# EAGLE design SuperCapacitor Schmatic V3 (EAGLE 9.5.2)
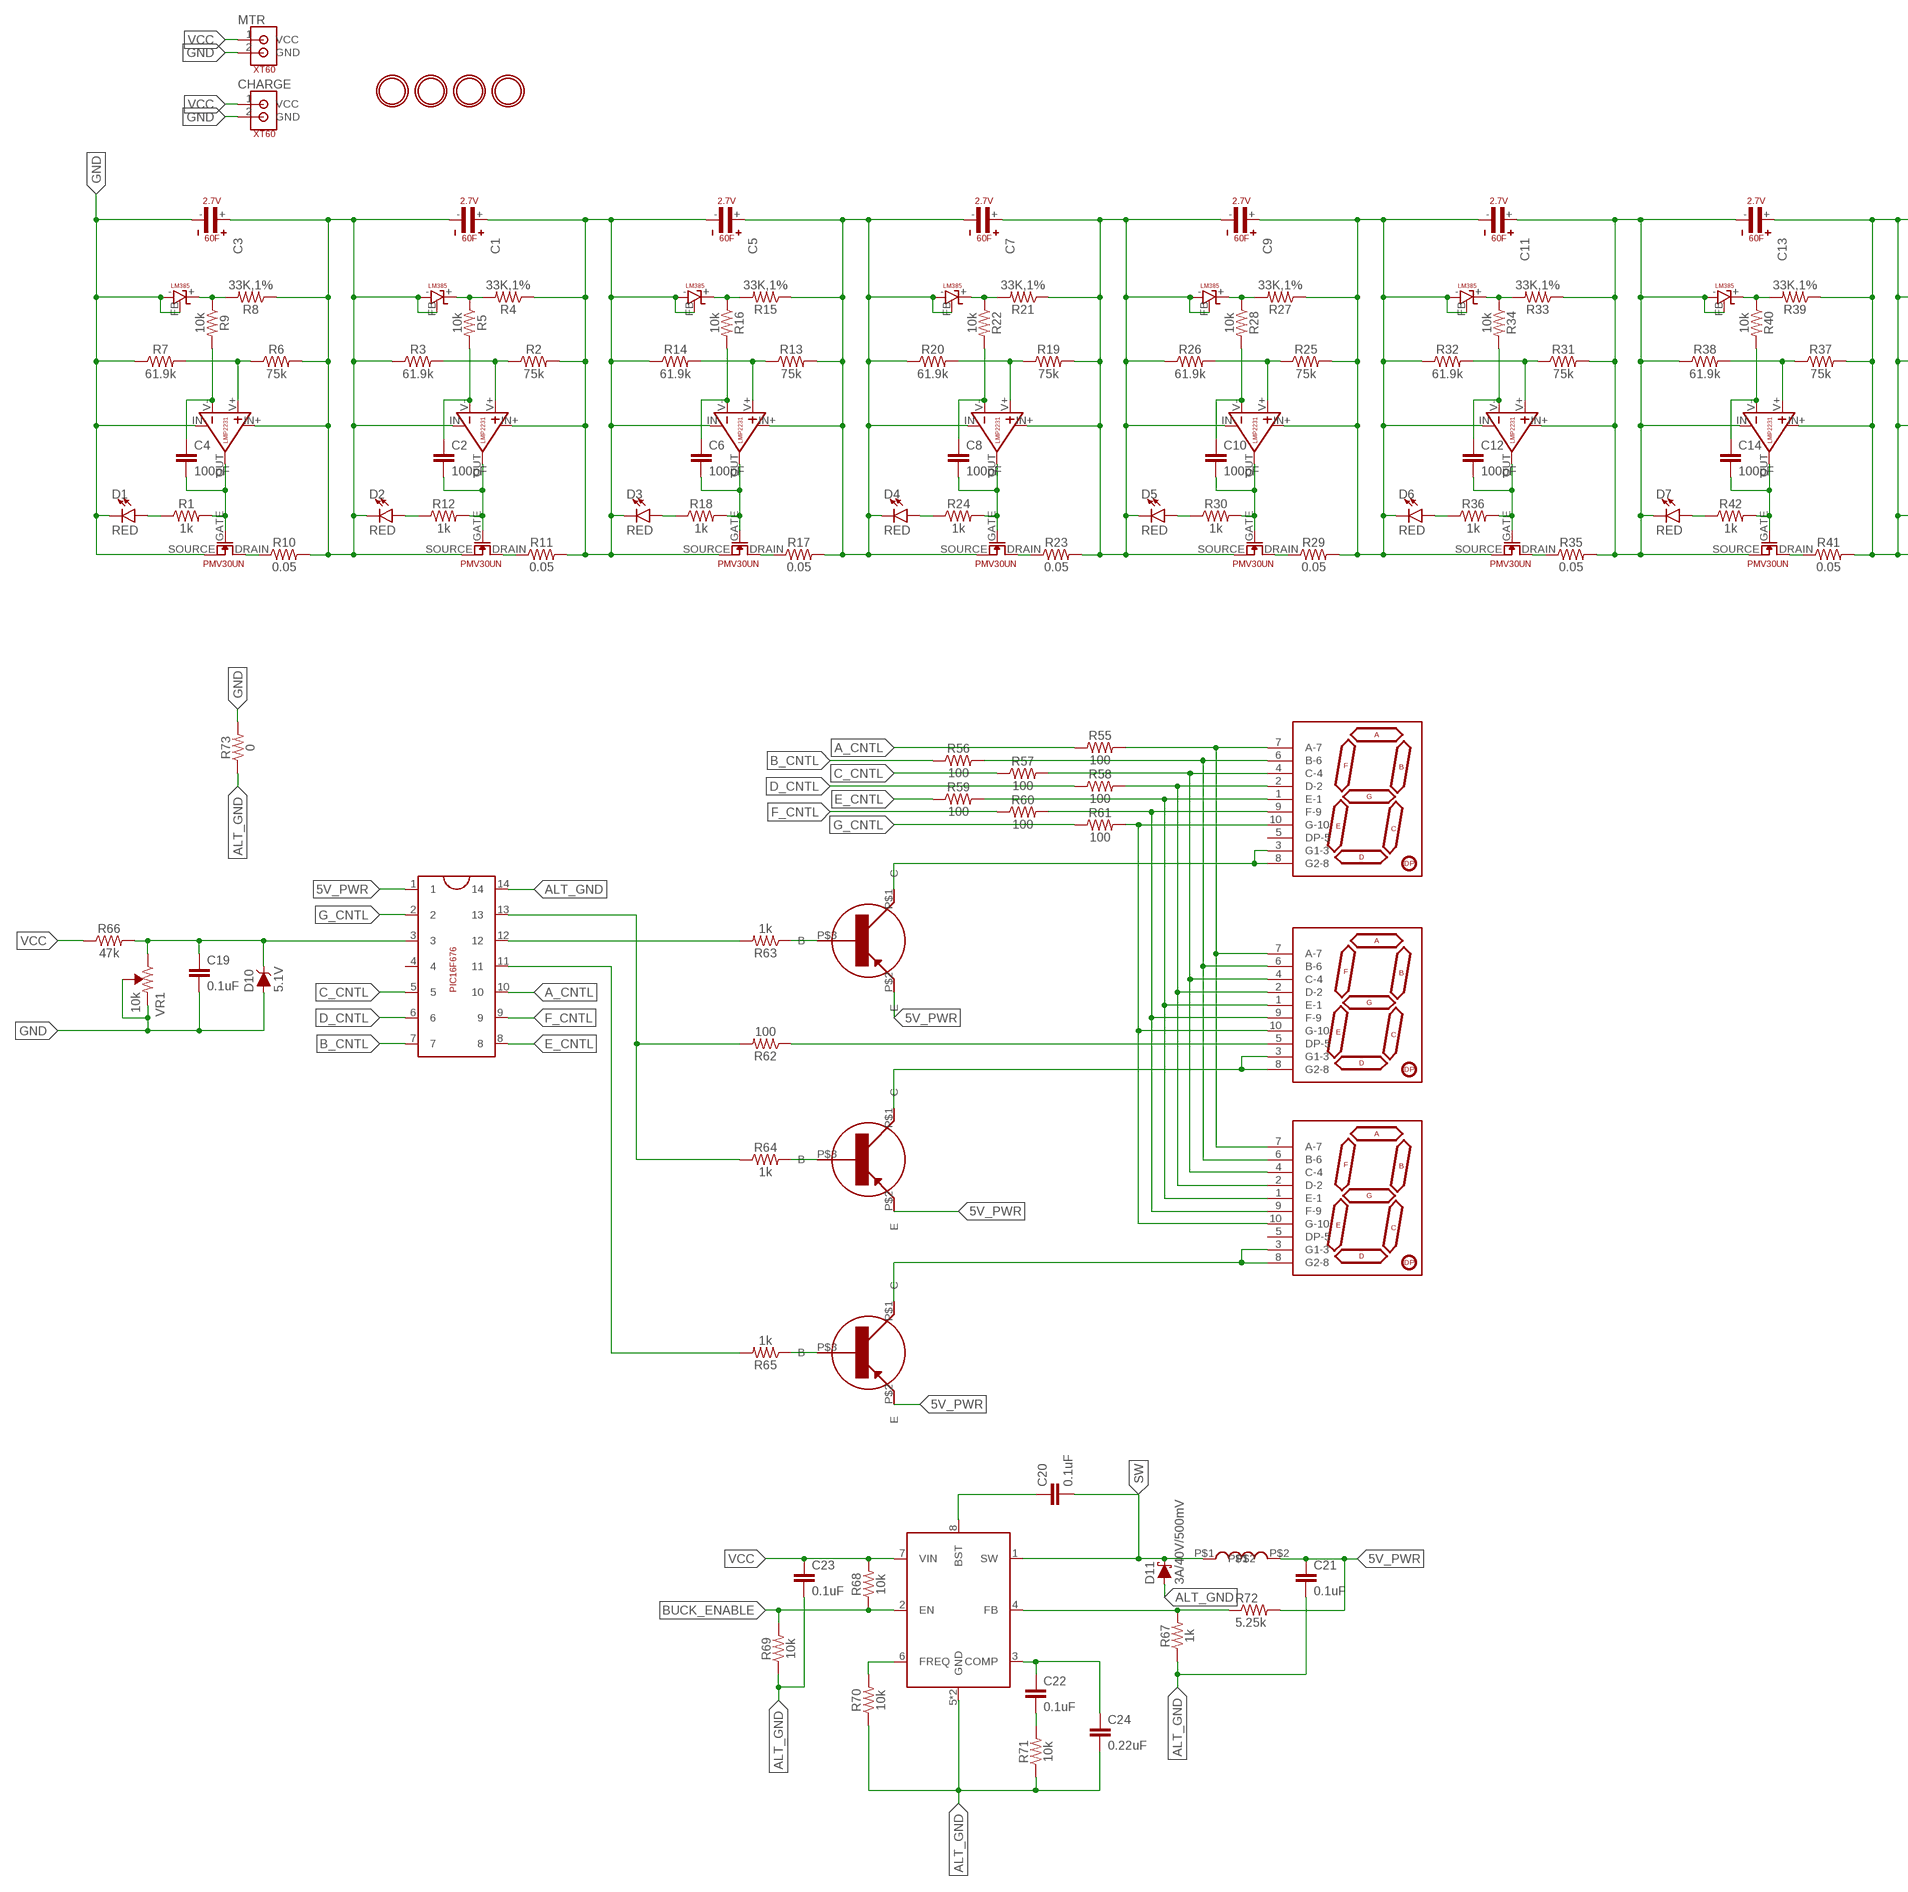
[diagram p0: schematic, sheet 1, part 1 of 2]
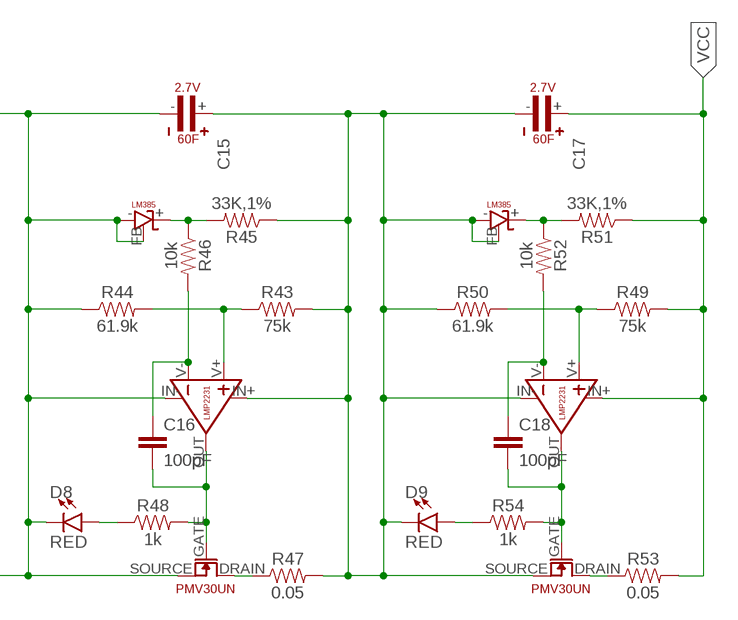
[diagram p1: schematic, sheet 1, part 2 of 2]

## Parts
3.3V_BUCK  SOIC8E  [SOIC127P600X170-9N]
C1  2.7V 60F  2.7V_60F  [2.7V_60F]
C2  100pF  100PF-0603-50V-5%  [0603]
C3  2.7V 60F  2.7V_60F  [2.7V_60F]
C4  100pF  100PF-0603-50V-5%  [0603]
C5  2.7V 60F  2.7V_60F  [2.7V_60F]
C6  100pF  100PF-0603-50V-5%  [0603]
C7  2.7V 60F  2.7V_60F  [2.7V_60F]
C8  100pF  100PF-0603-50V-5%  [0603]
C9  2.7V 60F  2.7V_60F  [2.7V_60F]
C10  100pF  100PF-0603-50V-5%  [0603]
C11  2.7V 60F  2.7V_60F  [2.7V_60F]
C12  100pF  100PF-0603-50V-5%  [0603]
C13  2.7V 60F  2.7V_60F  [2.7V_60F]
C14  100pF  100PF-0603-50V-5%  [0603]
C15  2.7V 60F  2.7V_60F  [2.7V_60F]
C16  100pF  100PF-0603-50V-5%  [0603]
C17  2.7V 60F  2.7V_60F  [2.7V_60F]
C18  100pF  100PF-0603-50V-5%  [0603]
C19  0.1uF  0.1UF-0603-25V-5%  [0603]
C20  0.1uF  0.1UF-0603-25V-(+80/-20%)  [0603]
C21  0.1uF  0.1UF-0603-25V-(+80/-20%)  [0603]
C22  0.1uF  0.1UF-0603-25V-(+80/-20%)  [0603]
C23  0.1uF  0.1UF-0603-25V-(+80/-20%)  [0603]
C24  0.22uF  0.22UF-0603-50V-(-20/+80%)  [0603]
CHARGE  XT60_CIRCLE  [XT60_CIRCLE]
D1  RED  LED-RED0603  [LED-0603]
D2  RED  LED-RED0603  [LED-0603]
D3  RED  LED-RED0603  [LED-0603]
D4  RED  LED-RED0603  [LED-0603]
D5  RED  LED-RED0603  [LED-0603]
D6  RED  LED-RED0603  [LED-0603]
D7  RED  LED-RED0603  [LED-0603]
D8  RED  LED-RED0603  [LED-0603]
D9  RED  LED-RED0603  [LED-0603]
D10  5.1V  DIODE-ZENER-MMSZ5232BS  [SOD-323]
D11  3A/40V/500mV  DIODE-SCHOTTKY-B340A  [SMA-DIODE]
MTR  XT60_CIRCLE  [XT60_CIRCLE]
R1  1k  1KOHM-0603-1/10W-1%  [0603]
R2  75k  75KOHM-0603-1/10W-1%  [0603@1]
R3  61.9k  75KOHM-0603-1/10W-1%  [0603@1]
R4  33K,1%  1MOHM-0603-1/4W-5%  [0603@1]
R5  10k  10KOHM-0603-1/10W-1%  [0603]
R6  75k  75KOHM-0603-1/10W-1%  [0603@1]
R7  61.9k  75KOHM-0603-1/10W-1%  [0603@1]
R8  33K,1%  1MOHM-0603-1/4W-5%  [0603@1]
R9  10k  10KOHM-0603-1/10W-1%  [0603]
R10  0.05  0.05OHM-2512-3W-1%  [2512]
R11  0.05  0.05OHM-2512-3W-1%  [2512]
R12  1k  1KOHM-0603-1/10W-1%  [0603]
R13  75k  75KOHM-0603-1/10W-1%  [0603@1]
R14  61.9k  75KOHM-0603-1/10W-1%  [0603@1]
R15  33K,1%  1MOHM-0603-1/4W-5%  [0603@1]
R16  10k  10KOHM-0603-1/10W-1%  [0603]
R17  0.05  0.05OHM-2512-3W-1%  [2512]
R18  1k  1KOHM-0603-1/10W-1%  [0603]
R19  75k  75KOHM-0603-1/10W-1%  [0603@1]
R20  61.9k  75KOHM-0603-1/10W-1%  [0603@1]
R21  33K,1%  1MOHM-0603-1/4W-5%  [0603@1]
R22  10k  10KOHM-0603-1/10W-1%  [0603]
R23  0.05  0.05OHM-2512-3W-1%  [2512]
R24  1k  1KOHM-0603-1/10W-1%  [0603]
R25  75k  75KOHM-0603-1/10W-1%  [0603@1]
R26  61.9k  75KOHM-0603-1/10W-1%  [0603@1]
R27  33K,1%  1MOHM-0603-1/4W-5%  [0603@1]
R28  10k  10KOHM-0603-1/10W-1%  [0603]
R29  0.05  0.05OHM-2512-3W-1%  [2512]
R30  1k  1KOHM-0603-1/10W-1%  [0603]
R31  75k  75KOHM-0603-1/10W-1%  [0603@1]
R32  61.9k  75KOHM-0603-1/10W-1%  [0603@1]
R33  33K,1%  1MOHM-0603-1/4W-5%  [0603@1]
R34  10k  10KOHM-0603-1/10W-1%  [0603]
R35  0.05  0.05OHM-2512-3W-1%  [2512]
R36  1k  1KOHM-0603-1/10W-1%  [0603]
R37  75k  75KOHM-0603-1/10W-1%  [0603@1]
R38  61.9k  75KOHM-0603-1/10W-1%  [0603@1]
R39  33K,1%  1MOHM-0603-1/4W-5%  [0603@1]
R40  10k  10KOHM-0603-1/10W-1%  [0603]
R41  0.05  0.05OHM-2512-3W-1%  [2512]
R42  1k  1KOHM-0603-1/10W-1%  [0603]
R43  75k  75KOHM-0603-1/10W-1%  [0603@1]
R44  61.9k  75KOHM-0603-1/10W-1%  [0603@1]
R45  33K,1%  1MOHM-0603-1/4W-5%  [0603@1]
R46  10k  10KOHM-0603-1/10W-1%  [0603]
R47  0.05  0.05OHM-2512-3W-1%  [2512]
R48  1k  1KOHM-0603-1/10W-1%  [0603]
R49  75k  75KOHM-0603-1/10W-1%  [0603@1]
R50  61.9k  75KOHM-0603-1/10W-1%  [0603@1]
R51  33K,1%  1MOHM-0603-1/4W-5%  [0603@1]
R52  10k  10KOHM-0603-1/10W-1%  [0603]
R53  0.05  0.05OHM-2512-3W-1%  [2512]
R54  1k  1KOHM-0603-1/10W-1%  [0603]
R55  100  100OHM-0603-1/4W-5%  [0603]
R56  100  100OHM-0603-1/4W-5%  [0603]
R57  100  100OHM-0603-1/4W-5%  [0603]
R58  100  100OHM-0603-1/4W-5%  [0603]
R59  100  100OHM-0603-1/4W-5%  [0603]
R60  100  100OHM-0603-1/4W-5%  [0603]
R61  100  100OHM-0603-1/4W-5%  [0603]
R62  100  100OHM-0603-1/4W-5%  [0603]
R63  1k  1KOHM-0603-1/10W-1%  [0603]
R64  1k  1KOHM-0603-1/10W-1%  [0603]
R65  1k  1KOHM-0603-1/10W-1%  [0603]
R66  47k  47KOHM-0603-1/10W-1%  [0603]
R67  1k  1KOHM-0603-1/10W-1%  [0603]
R68  10k  10KOHM-0603-1/10W-1%  [0603]
R69  10k  10KOHM-0603-1/10W-1%  [0603]
R70  10k  10KOHM-0603-1/10W-1%  [0603]
R71  10k  10KOHM-0603-1/10W-1%  [0603]
R72  5.25k  CRCW08050000Z0EA  [RES_0805]
R73  0  0OHM-0603-1/10W-5%  [0603]
U$1  LMP2231  [LMP2231_SOT23_5]
U$2  LM385  [LM385_SOT23]
U$3  PMV30UN_MOS  [PMV30UN_SOT23]
U$4  LMP2231  [LMP2231_SOT23_5]
U$5  LM385  [LM385_SOT23]
U$6  PMV30UN_MOS  [PMV30UN_SOT23]
U$7  LMP2231  [LMP2231_SOT23_5]
U$8  LM385  [LM385_SOT23]
U$9  PMV30UN_MOS  [PMV30UN_SOT23]
U$10  LMP2231  [LMP2231_SOT23_5]
U$11  LM385  [LM385_SOT23]
U$12  PMV30UN_MOS  [PMV30UN_SOT23]
U$13  LMP2231  [LMP2231_SOT23_5]
U$14  LM385  [LM385_SOT23]
U$15  PMV30UN_MOS  [PMV30UN_SOT23]
U$16  LMP2231  [LMP2231_SOT23_5]
U$17  LM385  [LM385_SOT23]
U$18  PMV30UN_MOS  [PMV30UN_SOT23]
U$19  LMP2231  [LMP2231_SOT23_5]
U$20  LM385  [LM385_SOT23]
U$21  PMV30UN_MOS  [PMV30UN_SOT23]
U$22  LMP2231  [LMP2231_SOT23_5]
U$23  LM385  [LM385_SOT23]
U$24  PMV30UN_MOS  [PMV30UN_SOT23]
U$25  LMP2231  [LMP2231_SOT23_5]
U$26  LM385  [LM385_SOT23]
U$27  PMV30UN_MOS  [PMV30UN_SOT23]
U$30  M5  [M5]
U$31  M5  [M5]
U$32  M5  [M5]
U$33  M5  [M5]
U$35  DSM7T  [7-SEGMENT_SMD]
U$36  DSM7T  [7-SEGMENT_SMD]
U$37  DSM7T  [7-SEGMENT_SMD]
U$38  PIC16F676  [PIC16F676]
U$39  4.7UH_INDUCTOR  [4.7UH_INDUCTOR]
U$40  SOT_223  [BC856BMB]
U$41  SOT_223  [BC856BMB]
U$42  SOT_223  [BC856BMB]
VR1  10k  TRIMPOT-SMD-3MM-OPEN-1/10W-25%  [TRIMPOT-SMD-TC33X]

## Nets
1 [discharge]: R17.P$1 U$9.DRAIN
5V_PWR: C21.1 R72.2 U$38.1 U$39.P$2 U$40.P$2(E) U$41.P$2(E) U$42.P$2(E)
A_CNTL: R55.1 U$38.10
ALT_GND [discharge]: 3.3V_BUCK.5(GND) 3.3V_BUCK.9(GND) C21.2 C23.2 C24.2 D11.A R67.1 R69.1 R70.1 R71.1 R73.1 U$38.14
B_CNTL: R56.1 U$38.7
BUCK_ENABLE: 3.3V_BUCK.2(EN) R68.1 R69.2
C_CNTL: R57.1 U$38.5
D_CNTL: R58.1 U$38.6
E_CNTL: R59.1 U$38.8
F_CNTL: R60.1 U$38.9
G_CNTL: R61.1 U$38.2
GND [discharge]: C3.- C19.2 CHARGE.2(GND) D1.C D10.A MTR.2(GND) R7.1 R73.2 U$4.IN- U$5.- U$5.FB U$6.SOURCE VR1.2(WIPER) VR1.3(CCW)
N$1: D1.A R1.1
N$2: U$37.3(G1-3) U$37.8(G2-8) U$41.P$1(C)
N$3: C2.2 R12.2 U$1.OUT U$3.GATE
N$4 [discharge]: C1.- C3.+ D2.C R3.1 R6.2 R8.1 R10.P$2 U$1.IN- U$2.- U$2.FB U$3.SOURCE U$4.IN+
N$5: R2.1 R3.2 U$1.V+
N$6: C2.1 R5.2 U$1.V-
N$7: R4.2 R5.1 U$2.+
N$8: U$36.3(G1-3) U$36.8(G2-8) U$42.P$1(C)
N$9: C4.2 R1.2 U$4.OUT U$6.GATE
N$10: R63.1 U$40.P$3(B)
N$11: R6.1 R7.2 U$4.V+
N$12: C4.1 R9.2 U$4.V-
N$13: R8.2 R9.1 U$5.+
N$14 [discharge]: R10.P$1 U$6.DRAIN
N$15 [discharge]: R11.P$1 U$3.DRAIN
N$16: D2.A R12.1
N$17: R64.2 U$41.P$3(B)
N$18: C6.2 R18.2 U$7.OUT U$9.GATE
N$19 [discharge]: C1.+ C5.- D3.C R2.2 R4.1 R11.P$2 R14.1 U$1.IN+ U$7.IN- U$8.- U$8.FB U$9.SOURCE
N$20: R13.1 R14.2 U$7.V+
N$21: C6.1 R16.2 U$7.V-
N$22: R15.2 R16.1 U$8.+
N$23: R62.1 U$37.5(DP-5)
N$24: D3.A R18.1
N$25: R62.2 R64.1 U$38.13
N$26: C8.2 R24.2 U$10.OUT U$12.GATE
N$27 [discharge]: C5.+ C7.- D4.C R13.2 R15.1 R17.P$2 R20.1 U$7.IN+ U$10.IN- U$11.- U$11.FB U$12.SOURCE
N$28: R19.1 R20.2 U$10.V+
N$29: C8.1 R22.2 U$10.V-
N$30: R21.2 R22.1 U$11.+
N$31 [discharge]: R23.P$1 U$12.DRAIN
N$32: D4.A R24.1
N$33: R63.2 U$38.12
N$34: C10.2 R30.2 U$13.OUT U$15.GATE
N$35 [discharge]: C7.+ C9.- D5.C R19.2 R21.1 R23.P$2 R26.1 U$10.IN+ U$13.IN- U$14.- U$14.FB U$15.SOURCE
N$36: R25.1 R26.2 U$13.V+
N$37: C10.1 R28.2 U$13.V-
N$38: R27.2 R28.1 U$14.+
N$39 [discharge]: R29.P$1 U$15.DRAIN
N$40: D5.A R30.1
N$41: C19.1 D10.C R66.2 U$38.3 VR1.1(CW)
N$42: C12.2 R36.2 U$16.OUT U$18.GATE
N$43 [discharge]: C9.+ C11.- D6.C R25.2 R27.1 R29.P$2 R32.1 U$13.IN+ U$16.IN- U$17.- U$17.FB U$18.SOURCE
N$44: R31.1 R32.2 U$16.V+
N$45: C12.1 R34.2 U$16.V-
N$46: R33.2 R34.1 U$17.+
N$47 [discharge]: R35.P$1 U$18.DRAIN
N$48: D6.A R36.1
N$49: R65.2 U$38.11
N$50: C14.2 R42.2 U$19.OUT U$21.GATE
N$51 [discharge]: C11.+ C13.- D7.C R31.2 R33.1 R35.P$2 R38.1 U$16.IN+ U$19.IN- U$20.- U$20.FB U$21.SOURCE
N$52: R37.1 R38.2 U$19.V+
N$53: C14.1 R40.2 U$19.V-
N$54: R39.2 R40.1 U$20.+
N$55 [discharge]: R41.P$1 U$21.DRAIN
N$56: D7.A R42.1
N$57: U$35.3(G1-3) U$35.8(G2-8) U$40.P$1(C)
N$58: C16.2 R48.2 U$22.OUT U$24.GATE
N$59: C13.+ C15.- D8.C R37.2 R39.1 R41.P$2 R44.1 U$19.IN+ U$22.IN- U$23.- U$23.FB U$24.SOURCE
N$60: R43.1 R44.2 U$22.V+
N$61: C16.1 R46.2 U$22.V-
N$62: R45.2 R46.1 U$23.+
N$63 [discharge]: R47.P$1 U$24.DRAIN
N$64: D8.A R48.1
N$65: R65.1 U$42.P$3(B)
N$66: C18.2 R54.2 U$25.OUT U$27.GATE
N$67 [discharge]: C15.+ C17.- D9.C R43.2 R45.1 R47.P$2 R50.1 U$22.IN+ U$25.IN- U$26.- U$26.FB U$27.SOURCE
N$68: R49.1 R50.2 U$25.V+
N$69: C18.1 R52.2 U$25.V-
N$70: R51.2 R52.1 U$26.+
N$71 [discharge]: R53.P$1 U$27.DRAIN
N$72: D9.A R54.1
N$73: R55.2 U$35.7(A-7) U$36.7(A-7) U$37.7(A-7)
N$74: R56.2 U$35.6(B-6) U$36.6(B-6) U$37.6(B-6)
N$75: R57.2 U$35.4(C-4) U$36.4(C-4) U$37.4(C-4)
N$76: R58.2 U$35.2(D-2) U$36.2(D-2) U$37.2(D-2)
N$77: R59.2 U$35.1(E-1) U$36.1(E-1) U$37.1(E-1)
N$78: R60.2 U$35.9(F-9) U$36.9(F-9) U$37.9(F-9)
N$79: R61.2 U$35.10(G-10) U$36.10(G-10) U$37.10(G-10)
N$81: 3.3V_BUCK.4(FB) R67.2 R72.1
N$82: 3.3V_BUCK.8(BST) C20.1
N$83: 3.3V_BUCK.6(FREQ) R70.2
N$84: 3.3V_BUCK.3(COMP) C22.1 C24.1
N$85: C22.2 R71.2
SW: 3.3V_BUCK.1(SW) C20.2 D11.C U$39.P$1
VCC [discharge]: 3.3V_BUCK.7(VIN) C17.+ C23.1 CHARGE.1(VCC) MTR.1(VCC) R49.2 R51.1 R53.P$2 R66.1 R68.2 U$25.IN+
Unconnected: U$35.5(DP-5) U$36.5(DP-5) U$38.4

## Library data of the parts
3.3V_BUCK = SOIC127P600X170-9N:SOIC8E
C1 C3 C5 C7 C9 C11 C13 C15 C17 = personal Made:2.7V_60F
C2 C4 C6 C8 C10 C12 C14 C16 C18 = SparkFun-Capacitors:100PF: 100pF/0.1nF ceramic capacitors A capacitor is a passive two-terminal electrical component used to store electrical energy temporarily in an electric field.; PROD_ID: CAP-07883
C19 = SparkFun-Capacitors:0.1UF: 0.1µF ceramic capacitors A capacitor is a passive two-terminal electrical component used to store electrical energy temporarily in an electric field.; PROD_ID: CAP-08604
C20-C23 = SparkFun-Capacitors:0.1UF: 0.1µF ceramic capacitors A capacitor is a passive two-terminal electrical component used to store electrical energy temporarily in an electric field.; PROD_ID: CAP-00810
C24 = SparkFun-Capacitors:0.22UF: 0.22µF ceramic capacitors A capacitor is a passive two-terminal electrical component used to store electrical energy temporarily in an electric field.; PROD_ID: CAP-09885
CHARGE MTR = NewKevinMade:XT60_CIRCLE
D1-D9 = SparkFun-LED:LED-RED: Red SMD LED Used in manufacturing of most products at SparkFun Packages: 0603 - SMD 0603 package [Product Link] <http://docs.avagotech.com/docs/AV02-0551EN> 0603 SMART - SMD 0603 SMART package ( more efficient and expensive)[Product Link] <http://www.osram-os.com/Graphics/XPic2/00077099_0.pdf> 1206 - SMD1206 package [Product Link] <https://www.sparkfun.com/datasheets/DevTools/LilyPad/Q150OVS4.pdff> SparkFun Products: Pro Mini 328 -5V <https://www.sparkfun.com/products/821> RedBoard <https://www.sparkfun.com/products/12757> IOIO-OTG <https://www.sparkfun.com/products/13613>; PROD_ID: DIO-00819
D10 = SparkFun-DiscreteSemi:DIODE-ZENER: Zener Diode A Zener diode allows current to flow from its anode to its cathode like a normal semiconductor diode, but it also permits current to flow in the reverse direction when its "Zener voltage" is reached. - WIkipedia; PROD_ID: DIO-12442; VALUE: 5.6V
D11 = SparkFun-DiscreteSemi:DIODE-SCHOTTKY: Schottky diode A Schottky diode is a semiconductor diode which has a low forward voltage drop and a very fast switching action.; PROD_ID: DIO-09886
R1 R12 R18 R24 R30 R36 R42 R48 R54 R63-R65 R67 = SparkFun-Resistors:1KOHM: 1kΩ resistor A resistor is a passive two-terminal electrical component that implements electrical resistance as a circuit element. Resistors act to reduce current flow, and, at the same time, act to lower voltage levels within circuits. - Wikipedia; PROD_ID: RES-07856
R2 R3 R6 R7 R13 R14 R19 R20 R25 R26 R31 R32 R37 R38 R43 R44 R49 R50 = SparkFun-Resistors:75KOHM: 75Ω resistor A resistor is a passive two-terminal electrical component that implements electrical resistance as a circuit element. Resistors act to reduce current flow, and, at the same time, act to lower voltage levels within circuits. - Wikipedia; PROD_ID: RES-09737; VALUE: 75
R4 R8 R15 R21 R27 R33 R39 R45 R51 = SparkFun-Resistors:1MOHM: 1MΩ resistor A resistor is a passive two-terminal electrical component that implements electrical resistance as a circuit element. Resistors act to reduce current flow, and, at the same time, act to lower voltage levels within circuits. - Wikipedia; PROD_ID: RES-07868; VALUE: 1M
R5 R9 R16 R22 R28 R34 R40 R46 R52 R68-R71 = SparkFun-Resistors:10KOHM: 10kΩ resistor A resistor is a passive two-terminal electrical component that implements electrical resistance as a circuit element. Resistors act to reduce current flow, and, at the same time, act to lower voltage levels within circuits. - Wikipedia; PROD_ID: RES-00824
R10 R11 R17 R23 R29 R35 R41 R47 R53 = SparkFun-Resistors:0.05OHM: 0.05Ω resistor A resistor is a passive two-terminal electrical component that implements electrical resistance as a circuit element. Resistors act to reduce current flow, and, at the same time, act to lower voltage levels within circuits. - Wikipedia; PROD_ID: RES-13771
R55-R62 = SparkFun-Resistors:100OHM: 100Ω resistor A resistor is a passive two-terminal electrical component that implements electrical resistance as a circuit element. Resistors act to reduce current flow, and, at the same time, act to lower voltage levels within circuits. - Wikipedia; PROD_ID: RES-12438
R66 = SparkFun-Resistors:47KOHM: 47kΩ resistor A resistor is a passive two-terminal electrical component that implements electrical resistance as a circuit element. Resistors act to reduce current flow, and, at the same time, act to lower voltage levels within circuits. - Wikipedia; PROD_ID: RES-07871
R72 = Resistor_Capacitor:CRCW08050000Z0EA: RES SMD 0 OHM JUMPER 1/8W 0805 Manufacturer's datasheet <http://www.vishay.com/docs/20035/dcrcwe3.pdf>; CREATED_BY: PCBLayout.com; DIGIKEY_PART_NUMBER: 541-0.0ATR-ND; MANUFACTURER: Vishay Dale; MPN: CRCW08050000Z0EA; PACKAGE: SMD 0805
R73 = SparkFun-Resistors:0OHM: 0Ω resistor A resistor is a passive two-terminal electrical component that implements electrical resistance as a circuit element. Resistors act to reduce current flow, and, at the same time, act to lower voltage levels within circuits. - Wikipedia; PROD_ID: RES-08609
U$1 U$4 U$7 U$10 U$13 U$16 U$19 U$22 U$25 = personal Made:LMP2231
U$2 U$5 U$8 U$11 U$14 U$17 U$20 U$23 U$26 = personal Made:LM385
U$3 U$6 U$9 U$12 U$15 U$18 U$21 U$24 U$27 = personal Made:PMV30UN_MOS
U$30-U$33 = NewKevinMade:M5
U$35-U$37 = Custom:DSM7T
U$38 = Custom:PIC16F676
U$39 = Custom:4.7UH_INDUCTOR
U$40-U$42 = Custom:SOT_223
VR1 = SparkFun-Resistors:TRIMPOT: Trimming Potentiometer (Trimpot) Three-terminal potentiometers, with an adjustable wiper and two adjustable resistors. A pot can be used to create a configurable voltage divider, or as a variable resistor. "Trimpots" are a subset of potentiometers, usually intended for "set-and-forget" applications. They're often more delicate than standard potentiometers - rated for fewer turns. Variants PTH-KNOB - PTH Trimpot w/ finger-adjustable knob Trimpot 10K with Knob <https://www.sparkfun.com/products/9806> (COM-09806) Datasheet <http://www.sparkfun.com/datasheets/Components/General/TSR-3386.pdf> SMD-3MM-CLOSED-FRAME - SMD 3mm Square Closed-Frame Trimpot Used on e.g. EasyDriver - Stepper Motor Driver <https://www.sparkfun.com/products/12779> Datasheet <http://www.bitechnologies.com/pdfs/22.pdf> (22AR10KTR) SMD-5MM - SMD 5mm Square Closed-Frame Trimpot Used on e.g. IOIO-OTG - V2.2 <https://www.sparkfun.com/products/13613> Datasheet <http://www.vishay.com/docs/51008/ts53.pdf> (TS53YL502MR10) SMD-3MM-1/10W-25% - 3mm Square Open-Frame Trimpot Used on e.g. SparkFun Shapeoko <https://www.sparkfun.com/products/13899> Datasheet <http://www.bourns.com/docs/Product-Datasheets/TC33.pdf> (TC33X-2-103E); PROD_ID: RES-12428

## Net classes
1 discharge: width 0.305 mm, drill 0.305 mm, clearance 0.152 mm

## Board
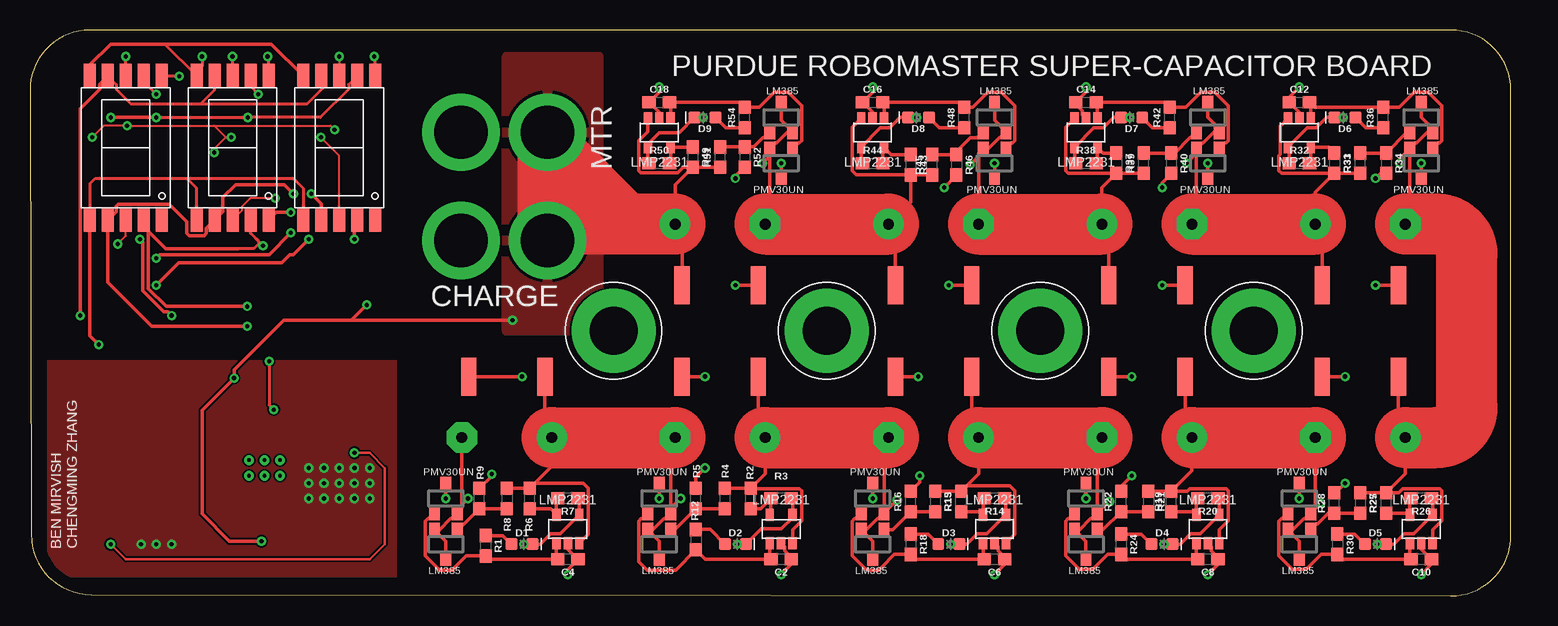
[diagram p2: board, top side]
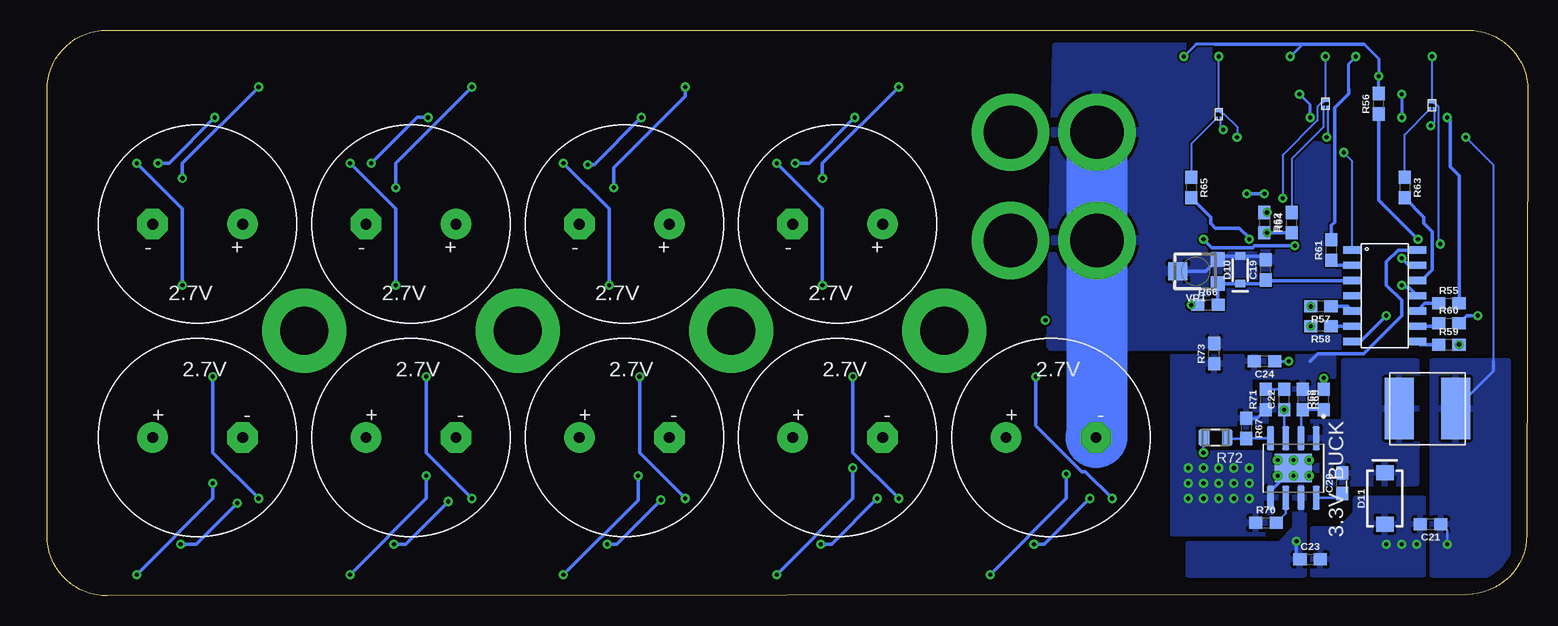
[diagram p3: board, bottom side, seen from below]

Size 123.41 x 47.16 mm. Coordinates in mm from the lower left corner, seen from the top.
Outline: 0,42.15 0.1,5.1 arc90 5.09,0.12 118.41,0 arc90 123.41,5 123.41,42.16 arc90 118.41,47.16 5,47.16 arc90 0,42.15
Copper layers (1*16): Top 0.035mm / dielectric 1.5mm / Bottom 0.035mm
Design rules "default": minimum track width 6mil, minimum drill 0.35mm, track to track 6mil, track to pad 6mil, pad to pad 6mil, via to via 6mil, smd to smd 6mil, copper to edge 40mil, drill to drill 6mil, minimum pad ring 10mil, minimum via ring 8mil, stop-mask expansion 4mil, vias tented up to drill 0mil, thermal gap 10mil

### Footprints (pad centres in the part's own frame; a part is rotated, then mirrored left to right if it is on the bottom)
SOIC127P600X170-9N = smd 1.97 x 0.6: 1 -2.475,1.905; 2 -2.475,0.635; 3 -2.475,-0.635; 4 -2.475,-1.905; 5 2.475,-1.905; 6 2.475,-0.635; 7 2.475,0.635; 8 2.475,1.905 | smd 2.4 x 3.1: 9 0,0 | drill 0.3 pad 0.4: V1 -0.65,1.3; V2 0.65,1.3; V3 -0.65,0; V4 0.65,0; V5 -0.65,-1.3; V6 0.65,-1.3
2.7V_60F = drill 0.9 pad 2.54: + -3.75,0 | drill 0.9 pad 2.54 octagon: - 3.75,0
0603 = smd 1.1 x 1: 1 -0.85,0; 2 0.85,0
XT60_CIRCLE = drill 4.45 pad 6.452: 1 -7.2,7.2; 2 0,7.2
LED-0603 = smd 1 x 1: A -0.877,0; C 0.877,0
SOD-323 = smd 0.63 x 0.83: A 1.15,0; C -1.15,0
SMA-DIODE = smd 1.27 x 1.47: A -2.15,0; C 2.15,0
0603@1 = smd 1.1 x 1: 1 -0.85,0; 2 0.85,0
2512 = smd 1.27 x 3.175: P$1 -3.175,0; P$2 3.175,0
RES_0805 = smd 0.87 x 1.42: 1 -0.975,0; 2 0.975,0
LMP2231_SOT23_5 = smd 0.7 x 1: IN+ 0.95,-1.2; IN- 0.95,1.2; OUT -0.95,-1.2; V+ -0.95,1.2; V- 0,-1.2
LM385_SOT23 = smd 0.9 x 1.2: + -0.95,-1.2; - 0.95,-1.2; FB 0,1.2
PMV30UN_SOT23 = smd 0.9 x 1.2: DRAIN 0,1.2; GATE -0.95,-1.2; SOURCE 0.95,-1.2
M5 = drill 4 pad 7: P$1 0,0
7-SEGMENT_SMD = smd 1 x 2: 1 -3,-6; 2 -1.5,-6; 3 0,-6; 4 1.5,-6; 5 3,-6; 6 3,6; 7 1.5,6; 8 0,6; 9 -1.5,6; 10 -3,6
PIC16F676 = smd 0.6 x 1.5: 1 -3.81,-2.7; 2 -2.54,-2.7; 3 -1.27,-2.7; 4 0,-2.7; 5 1.27,-2.7; 6 2.54,-2.7; 7 3.81,-2.7; 8 3.81,2.7; 9 2.54,2.7; 10 1.27,2.7; 11 0,2.7; 12 -1.27,2.7; 13 -2.54,2.7; 14 -3.81,2.7
4.7UH_INDUCTOR = smd 2.4 x 5.1: P$1 -2.35,0; P$2 2.35,0
BC856BMB = smd 0.55 x 0.3: P$1 0,-0.325 | smd 0.2 x 0.3: P$2 -0.175,0.325; P$3 0.175,0.325
TRIMPOT-SMD-TC33X = smd 1.2 x 1.2: 1 -1,-1.825; 3 1,-1.825 | smd 1.5 x 1.6: 2 0,1.5

### Placement (x,y rotation side)
3.3V_BUCK  19.54,10.66 270 bottom
C1  57.52,13.2 0 bottom
C2  62.6,3.04 180 top
C3  39.74,13.2 0 bottom
C4  44.82,3.04 180 top
C5  75.3,13.2 0 bottom
C6  80.38,3.04 180 top
C7  93.08,13.2 0 bottom
C8  98.16,3.04 180 top
C9  110.86,13.2 0 bottom
C10  115.94,3.04 180 top
C11  110.86,30.98 180 bottom
C12  105.78,41.14 0 top
C13  93.08,30.98 180 bottom
C14  88,41.14 0 top
C15  75.3,30.98 180 bottom
C16  70.22,41.14 0 top
C17  57.52,30.98 180 bottom
C18  52.44,41.14 0 top
C19  21.83,27.17 90 bottom
C20  15.48,9.39 90 bottom
C21  8.11,5.96 180 bottom
C22  20.31,16.38 90 bottom
C23  18.15,3.04 0 bottom
C24  21.96,19.55 180 bottom
CHARGE  35.93,36.82 180 top
D1  41.01,4.31 0 top
D2  58.79,4.31 0 top
D3  76.57,4.31 0 top
D4  94.35,4.31 0 top
D5  112.13,4.31 0 top
D6  109.59,39.87 180 top
D7  91.81,39.87 180 top
D8  74.03,39.87 180 top
D9  56.25,39.87 180 top
D10  23.99,27.17 90 bottom
D11  11.92,8.12 90 bottom
MTR  35.93,45.84 180 top
R1  37.96,4.19 270 top
R2  60.06,8.12 90 top
R3  62.6,8.12 180 top
R4  57.9,8.12 270 top
R5  55.49,8.12 90 top
R6  41.64,8.12 90 top
R7  44.82,8.12 180 top
R8  39.74,8.12 270 top
R9  37.45,8.12 90 top
R10  39.74,18.28 0 top
R11  57.52,18.28 0 top
R12  55.49,4.69 270 top
R13  77.58,7.87 90 top
R14  80.38,8.12 180 top
R15  75.42,7.87 270 top
R16  73.39,7.87 90 top
R17  75.3,18.28 0 top
R18  73.39,4.31 270 top
R19  95.11,7.87 90 top
R20  98.16,8.12 180 top
R21  93.2,7.87 270 top
R22  90.92,7.87 90 top
R23  93.08,18.28 0 top
R24  90.92,4.31 270 top
R25  113.02,7.74 90 top
R26  115.94,8.12 180 top
R27  110.86,7.74 270 top
R28  108.7,7.74 90 top
R29  110.86,18.28 0 top
R30  108.95,4.31 270 top
R31  108.7,36.06 270 top
R32  105.78,36.06 0 top
R33  110.86,36.06 90 top
R34  113.02,36.06 270 top
R35  110.86,25.9 180 top
R36  112.76,39.87 90 top
R37  90.54,36.06 270 top
R38  88,36.06 0 top
R39  92.82,36.06 90 top
R40  95.11,36.06 270 top
R41  93.08,25.9 180 top
R42  94.98,39.87 90 top
R43  73.39,35.94 270 top
R44  70.22,36.06 0 top
R45  75.17,35.94 90 top
R46  77.2,35.94 270 top
R47  75.3,25.9 180 top
R48  77.84,39.87 90 top
R49  55.23,36.57 270 top
R50  52.44,36.06 0 top
R51  57.52,36.57 90 top
R52  59.55,36.57 270 top
R53  57.52,25.9 180 top
R54  59.55,39.87 90 top
R55  6.59,24.38 0 bottom
R56  12.43,41.02 90 bottom
R57  17.26,24.12 180 bottom
R58  17.26,22.47 180 bottom
R59  6.59,20.95 0 bottom
R60  6.59,22.73 0 bottom
R61  16.37,28.82 90 bottom
R62  21.96,31.11 270 bottom
R63  10.27,34.03 270 bottom
R64  19.67,31.11 90 bottom
R65  28.05,34.03 270 bottom
R66  26.66,24.25 0 bottom
R67  23.48,13.96 270 bottom
R68  17,16.38 90 bottom
R69  18.78,16.38 270 bottom
R70  21.83,6.09 0 bottom
R71  21.83,16.38 90 bottom
R72  26.02,13.2 180 bottom
R73  26.15,20.19 90 bottom
U$1  62.6,5.58 0 top
U$2  52.44,4.31 180 top
U$3  52.44,8.12 0 top
U$4  44.82,5.58 0 top
U$5  34.66,4.31 180 top
U$6  34.66,8.12 0 top
U$7  80.38,5.58 0 top
U$8  70.22,4.31 180 top
U$9  70.22,8.12 0 top
U$10  98.16,5.58 0 top
U$11  88,4.31 180 top
U$12  88,8.12 0 top
U$13  115.94,5.58 0 top
U$14  105.78,4.31 180 top
U$15  105.78,8.12 0 top
U$16  105.78,38.6 180 top
U$17  115.94,39.87 0 top
U$18  115.94,36.06 180 top
U$19  88,38.6 180 top
U$20  98.16,39.87 0 top
U$21  98.16,36.06 180 top
U$22  70.22,38.6 180 top
U$23  80.38,39.87 0 top
U$24  80.38,36.06 180 top
U$25  52.44,38.6 180 top
U$26  62.6,39.87 0 top
U$27  62.6,36.06 180 top
U$30  84.19,22.09 0 top
U$31  101.97,22.09 0 top
U$32  48.63,22.09 0 top
U$33  66.41,22.09 0 top
U$35  7.99,37.33 0 top
U$36  25.77,37.33 0 top
U$37  16.88,37.33 0 top
U$38  11.92,25.01 270 bottom
U$39  8.37,15.62 0 bottom
U$40  7.99,40.89 180 bottom
U$41  16.88,41.02 180 bottom
U$42  25.77,40.13 180 bottom
VR1  27.67,27.05 90 bottom

### Tracks (layer width: path | path; a pad name or v marks a point on that pad's centre or on a via)
1  (via drill 0.35)
  Top 0.305: U$9.DRAIN v70.22,8.12 | v74.03,18.28 R17.P$1
  Bottom 0.305: v70.22,8.12 74.03,11.93 v74.03,18.28
5V_PWR  (via drill 0.35)
  Top 0.152: 15.35,39.19 v8.09,39.19 6.16,39.19 v5.19,38.22 | 15.35,39.19 25.05,39.19 v25.38,38.85 | v16.78,38.22 16.32,38.22 | 16.32,38.22 15.35,39.19 | v15.35,36.95 15.35,37.25 16.32,38.22
  Top 0.203: v27.04,11.93 28.31,11.93 29.58,10.66 29.58,4.31 28.31,3.04 7.99,3.04 v6.72,4.31
  Bottom 0.152: U$40.P$2 7.81,39.47 v8.09,39.19 | v25.38,38.85 25.59,39.06 U$42.P$2 | U$41.P$2 16.7,38.3 v16.78,38.22 | U$38.1 14.62,36.22 v15.35,36.95 | v5.19,38.22 2.91,35.94 2.91,19.17
  Bottom 0.203: R72.2 27.04,13.16 v27.04,11.93 | v6.72,4.31 6.72,5.42 C21.1
  Bottom 0.254: 14.58,28.87 U$38.1 | 2.91,19.55 2.91,19.17 2.91,18.73 U$39.P$2
  pour Bottom: 1.64,19.55 7.99,19.55 7.99,1.77 1.64,1.77
A_CNTL
  Bottom 0.305: R55.1 8.59,24.38 U$38.10
ALT_GND  (via drill 0.35)
  Bottom 0.305: U$38.14 10.81,28.82 11.8,27.84 11.8,25.9 10.53,24.63 10.53,23.36 13.7,20.19 17.51,20.19 18.15,19.55 | R71.1 22.54,14.81 R67.1 | 3.3V_BUCK.9 21.45,8.76 3.3V_BUCK.5
  other vias: 23.23,10.66 24.5,10.66 25.77,10.66 27.04,10.66 28.31,10.66 28.31,9.39 27.04,9.39 25.77,9.39 24.5,9.39 23.23,9.39 23.23,8.12 24.5,8.12 25.77,8.12 27.04,8.12 28.31,8.12 9.26,4.31 10.53,4.31 11.8,4.31
  pour Bottom: 8.75,8.12 8.75,1.77 17.89,1.77 17.89,5.58 15.61,5.58 14.34,6.85 14.34,8.12
  pour Bottom: 20.69,11.93 20.31,11.55 17.64,11.55 17.64,9.9 21.07,9.9 21.07,7.11 21.32,6.85 21.96,6.85 21.96,5.2 29.58,5.2 29.58,19.93 16.24,19.93 16.24,18.28 17.89,18.28 17.89,17.14 18.02,17.01 18.02,16.63 18.27,16.38 19.54,16.38 19.54,18.16 19.67,18.28 23.23,18.28 23.23,17.01 22.59,16.38 21.2,16.38 21.2,14.6 22.21,14.6 22.72,14.09 23.86,14.09 23.99,13.96 24.37,14.35 28.05,14.35 27.93,14.22 27.93,11.93
  pour Top: 1.51,19.55 1.51,1.65 30.47,1.65 30.47,19.55
B_CNTL  (via drill 0.35)
  Top 0.305: v9.16,29.71 9.39,29.49 9.39,25.43 11.15,23.67 11.49,23.67 v11.8,23.36
  Bottom 0.305: R56.1 12.43,32.98 v9.16,29.71 | v11.8,23.36 13.96,21.2 U$38.7
BUCK_ENABLE
  Bottom 0.203: R68.1 R69.2 18.91,15.4 3.3V_BUCK.2
C_CNTL
  Bottom 0.305: R57.1 15.01,24.12 U$38.5
D_CNTL
  Bottom 0.305: R58.1 U$38.6
E_CNTL
  Bottom 0.305: U$38.8 8.97,20.95 R59.1
F_CNTL
  Bottom 0.305: U$38.9 7.69,22.47 R60.1
G_CNTL
  Bottom 0.305: R61.1 15.95,27.55 U$38.2
GND  (via drill 0.35)
  Top 0.305: C3.- 35.99,7.3 U$6.SOURCE | U$6.SOURCE 35.1,6.42 35.03,6.42 34.13,5.51 U$5.- 34.66,4.56 U$5.FB | U$6.SOURCE 35.61,7.23 v36.5,8.12 | v41.16,4.31 D1.C 42.52,4.31 43.39,5.19 44.17,5.19 U$4.IN- 45.77,8.02 R7.1
  Bottom 0.305: v36.5,8.12 40.31,4.31 v41.16,4.31 | C3.- 35.99,12.41 | VR1.2 26.85,27.05 VR1.3 25.57,28.32 D10.A 22.13,28.32 C19.2
  Bottom 5.08: C3.- 35.93,13.26 CHARGE.2 MTR.2
  pour Bottom: 1.38,46.22 1.38,20.82 39.71,20.82 39.22,45.84
N$1
  Top 0.305: R1.1 39.41,5.04 D1.A
N$2  (via drill 0.35)
  Top 0.152: U$37.3 17.65,32.1 17.65,32.43 18.36,33.14 v20.43,33.14
  Top 0.254: U$37.8 v16.88,44.95
  Bottom 0.152: v16.88,44.95 U$41.P$1 17.15,41.07 17.25,41.07 17.54,40.78 17.54,39.62 20.43,36.73 v20.43,33.14
N$3
  Top 0.305: U$3.GATE 50.98,6.42 50.91,6.42 50.73,6.24 50.73,2.84 51.42,2.15 53.8,2.15 R12.2 56.29,3.04 C2.2 61.65,3.14 U$1.OUT
N$4  (via drill 0.35)
  Top 0.305: R10.P$2 42.91,13.78 C3.+ 43.49,10.82 R6.2 | U$3.SOURCE 52.88,6.42 52.81,6.42 51.91,5.51 U$2.- 52.44,4.56 U$2.FB | U$3.SOURCE 53.39,12.82 C1.- | R6.2 R8.1 | R6.2 42.06,9.39 46.09,9.39 46.52,8.96 46.52,5.14 U$4.IN+ | R3.1 63.55,8.02 U$1.IN- 63.55,6.53 62.6,5.58 60.93,5.58 D2.C v58.94,4.31 | v54.22,8.12 53.39,7.29 U$3.SOURCE
  Top 5.08: C3.+ C1.-
  Bottom 0.305: v58.94,4.31 58.03,4.31 v54.22,8.12
N$5
  Top 0.305: R2.1 60.9,7.27 R3.2 61.75,6.88 U$1.V+
N$6  (via drill 0.35)
  Top 0.305: U$1.V- 62.89,4.09 62.89,3.76 63.45,3.2 C2.1 63.45,2.62 v62.6,1.77 | v56.25,10.66 55.49,9.9 R5.2
  Bottom 0.305: v62.6,1.77 56.25,8.12 v56.25,10.66
N$7
  Top 0.305: R4.2 R5.1 53.73,5.51 U$2.+
N$8  (via drill 0.35)
  Top 0.152: v25.77,44.95 U$36.8 | U$36.3 25.77,36.7 v24.24,38.22
  Bottom 0.152: v25.77,44.95 U$42.P$1 25.5,40.18 25.34,40.18 24.24,39.08 v24.24,38.22
N$9
  Top 0.305: U$6.GATE 33.2,6.42 33.13,6.42 32.95,6.24 32.95,3.34 34.08,2.21 34.1,2.21 34.15,2.15 35.18,2.15 35.41,2.39 35.41,2.4 36.35,3.34 R1.2 38.25,3.04 C4.2 43.87,3.14 U$4.OUT
N$10
  Bottom 0.152: U$40.P$3 10.27,38.45 R63.1
N$11
  Top 0.305: R6.1 43.38,7.27 U$4.V+ 43.87,8.02 R7.2
N$12  (via drill 0.35)
  Top 0.305: U$4.V- 44.82,3.89 C4.1 44.82,2.19 v44.82,1.77 | v38.47,10.15 38.47,9.99 R9.2
  Bottom 0.305: v44.82,1.77 38.47,8.12 v38.47,10.15
N$13
  Top 0.305: R8.2 R9.1 35.69,5.51 U$5.+
N$14  (via drill 0.35)
  Top 0.305: U$6.DRAIN v34.66,8.12 | v41.01,18.28 R10.P$1
  Bottom 0.305: v34.66,8.12 36.89,10.36 37.17,10.36 41.01,14.2 v41.01,18.28
N$15  (via drill 0.35)
  Top 0.305: R11.P$1 v56.25,18.28 | v52.44,8.12 U$3.DRAIN
  Bottom 0.305: v56.25,18.28 56.25,11.93 v52.44,8.12
N$16
  Top 0.305: R12.1 56.68,5.54 D2.A
N$17
  Bottom 0.152: U$41.P$3 17.05,39.06 19.67,36.44 R64.2
N$18
  Top 0.305: U$9.GATE 68.76,6.42 68.69,6.42 68.51,6.24 68.51,3.34 69.64,2.21 69.78,2.21 69.84,2.15 70.74,2.15 70.97,2.39 70.97,2.4 72.03,3.46 R18.2 73.81,3.04 C6.2 79.43,3.14 U$7.OUT
N$19  (via drill 0.35)
  Top 0.305: R11.P$2 60.69,13.78 C1.+ 61.27,10.18 R2.2 | U$9.SOURCE 71.17,12.82 C5.- | U$9.SOURCE 70.66,6.42 70.59,6.42 69.69,5.51 U$8.- 70.22,4.56 U$8.FB | R4.1 R2.2 | R2.2 60.1,8.93 64.12,8.93 64.3,8.75 64.3,6.26 63.55,5.5 U$1.IN+ | R14.1 81.33,8.02 U$7.IN- 79.73,5.19 78.95,5.19 78.08,4.31 D3.C v76.72,4.31 | U$9.SOURCE 72.24,8 v72.25,8
  Top 5.08: C1.+ C5.-
  Bottom 0.305: v72.25,8 75.93,4.31 v76.72,4.31
N$20
  Top 0.305: R14.2 79.43,8.02 U$7.V+ 79.19,7.02 R13.1
N$21  (via drill 0.35)
  Top 0.305: U$7.V- 80.67,4.09 80.67,3.76 81.23,3.2 C6.1 81.23,2.62 v80.38,1.77 | v74.15,10.03 74.15,9.48 R16.2
  Bottom 0.305: v80.38,1.77 74.15,8 v74.15,10.03
N$22
  Top 0.305: R15.2 R16.1 71.89,5.51 U$8.+
N$23  (via drill 0.35)
  Top 0.305: v21.74,31.96 20.5,31.96 U$37.5
  Bottom 0.305: R62.1 v21.74,31.96
N$24
  Top 0.305: R18.1 74.84,5.16 D3.A
N$25  (via drill 0.35)
  Top 0.305: v10.53,28.14 10.83,28.44 19.92,28.44 v21.74,30.26
  Bottom 0.305: R62.2 v21.74,30.26 R64.1 | 9.64,27.55 U$38.13 9.94,27.55 v10.53,28.14
N$26
  Top 0.305: U$10.OUT 97.21,3.14 C8.2 91.34,3.04 R24.2 89.83,3.46 88.57,2.21 87.42,2.21 86.29,3.34 86.29,6.24 86.47,6.42 86.54,6.42 U$12.GATE
N$27  (via drill 0.35)
  Top 0.305: R17.P$2 78.47,13.78 C5.+ 79.05,10.18 R13.2 | U$12.SOURCE 88.44,6.42 88.37,6.42 87.47,5.51 U$11.- 88,4.56 U$11.FB | U$12.SOURCE 88.95,12.82 C7.- | R13.2 R15.1 | R13.2 78.26,9.39 | U$7.IN+ 82.08,5.14 82.08,8.75 81.65,9.18 78.05,9.18 R13.2 | R20.1 99.11,8.02 U$10.IN- 97.51,5.19 96.73,5.19 95.86,4.31 D4.C v94.5,4.31 | U$12.SOURCE 89.89,7.87 v89.97,7.87
  Top 5.08: C5.+ C7.-
  Bottom 0.305: v89.97,7.87 93.52,4.31 v94.5,4.31
N$28
  Top 0.305: R20.2 97.21,8.02 U$10.V+ 96.97,7.02 R19.1
N$29  (via drill 0.35)
  Top 0.305: U$10.V- 98.45,4.09 98.45,3.76 99.01,3.2 C8.1 99.01,2.62 v98.16,1.77 | v91.81,10.03 90.92,9.14 R22.2
  Bottom 0.305: v98.16,1.77 91.81,8.12 v91.81,10.03
N$30
  Top 0.305: R21.2 R22.1 89.41,5.51 U$11.+
N$31  (via drill 0.35)
  Top 0.305: U$12.DRAIN v88,8.12 | v91.81,18.28 R23.P$1
  Bottom 0.305: v88,8.12 91.81,11.93 v91.81,18.28
N$32
  Top 0.305: R24.1 92.62,5.16 D4.A
N$33
  Bottom 0.305: R63.2 8.67,31.58 8.67,31.05 7.99,30.37 7.99,27.17 8.88,26.28 U$38.12
N$34
  Top 0.305: U$15.GATE 104.32,6.42 104.25,6.42 104.07,6.24 104.07,3.34 105.2,2.21 106.35,2.21 107.61,3.46 R30.2 109.37,3.04 C10.2 114.99,3.14 U$13.OUT
N$35  (via drill 0.35)
  Top 0.305: R23.P$2 96.25,13.78 C7.+ 96.83,10.44 R19.2 | U$15.SOURCE 106.22,6.42 106.15,6.42 105.25,5.51 U$14.- 105.78,4.56 U$14.FB | R21.1 R19.2 | R19.2 96.42,8.72 96.63,8.93 99.68,8.93 99.86,8.75 99.86,6.26 99.11,5.5 U$10.IN+ | R26.1 116.89,8.02 U$13.IN- 115.29,5.19 114.51,5.19 113.64,4.31 D5.C v112.28,4.31 | U$15.SOURCE v107.55,7.74 v107.56,7.74 | C9.- 107.11,7.3 U$15.SOURCE
  Top 5.08: C7.+ C9.-
  Bottom 0.305: v107.56,7.74 110.98,4.31 v112.28,4.31
N$36
  Top 0.305: R25.1 114.88,6.89 U$13.V+ 114.99,8.02 R26.2
N$37  (via drill 0.35)
  Top 0.305: U$13.V- 115.94,3.89 C10.1 116.79,2.62 v115.94,1.77 | v109.59,9.39 108.79,8.59 R28.2
  Bottom 0.305: v115.94,1.77 109.59,8.12 v109.59,9.39
N$38
  Top 0.305: U$14.+ 107.23,6.02 107.3,6.02 108.18,6.89 R28.1 R27.2
N$39  (via drill 0.35)
  Top 0.305: U$15.DRAIN v105.78,8.12 | v109.59,18.28 R29.P$1
  Bottom 0.305: v105.78,8.12 109.59,11.93 v109.59,18.28
N$40
  Top 0.305: R30.1 110.4,5.16 D5.A
N$41
  Bottom 0.305: R66.2 25.85,24.29 VR1.1 25.82,26.02 D10.C 22.13,26.02 C19.1 21.79,26.28 U$38.3
N$42
  Top 0.305: C12.2 106.73,41.04 | 106.73,41.04 U$16.OUT | U$18.GATE 117.39,37.77 117.46,37.77 117.64,37.95 117.64,40.85 116.51,41.98 115.36,41.98 114.11,40.72 R36.2 107.05,40.72 106.73,41.04
N$43  (via drill 0.35)
  Top 0.305: R29.P$2 114.03,13.78 C9.+ 114.61,10.18 R25.2 | U$18.SOURCE 115.49,37.77 115.56,37.77 116.47,38.67 U$17.- 116.89,38.92 115.94,39.87 U$17.FB | U$18.SOURCE 114.99,31.36 C11.- | R27.1 R25.2 | U$13.IN+ 116.89,5.5 117.64,6.26 117.64,8.75 117.46,8.93 114.41,8.93 114.08,8.59 R25.2 | U$18.SOURCE 114.16,36.43 v114.16,36.06 | v109.43,39.87 D6.C 108.08,39.87 107.2,39 106.42,39 U$16.IN- 104.93,37.3 R32.1
  Top 5.08: C9.+ 117.21,13.2 arc90 119.75,15.74 119.75,28.44 arc90 117.21,30.98 C11.-
  Bottom 0.305: v114.16,36.06 113.24,36.06 v109.43,39.87
N$44
  Top 0.305: R31.1 108.21,37.4 U$16.V+ 106.73,36.16 R32.2
N$45  (via drill 0.35)
  Top 0.305: U$16.V- 105.78,40.29 C12.1 104.93,41.56 v105.78,42.41 | v112.13,34.79 112.55,35.21 R34.2
  Bottom 0.305: v105.78,42.41 112.13,36.06 v112.13,34.79
N$46
  Top 0.305: R33.2 R34.1 114.78,38.67 U$17.+
N$47  (via drill 0.35)
  Top 0.305: U$18.DRAIN v115.94,36.06 | v112.13,25.9 R35.P$1
  Bottom 0.305: v115.94,36.06 112.13,32.25 v112.13,25.9
N$48
  Top 0.305: R36.1 111.31,39.02 D6.A
N$49  (via drill 0.35)
  Top 0.305: v23.23,29.71 21.96,28.44 21.65,28.44 20.97,27.76 12.38,27.76 v10.53,25.9
  Bottom 0.305: U$38.11 9.89,25.68 10.1,25.68 10.32,25.9 v10.53,25.9 | v23.23,29.71 23.23,29.84 24.04,30.65 26.05,30.65 26.45,31.05 26.45,31.58 R65.2
N$50
  Top 0.305: U$19.OUT 88.95,41.04 C14.2 94.56,41.14 R42.2 96.33,40.72 97.58,41.98 98.73,41.98 99.86,40.85 99.86,37.95 99.68,37.77 99.61,37.77 U$21.GATE
N$51  (via drill 0.35)
  Top 0.305: R35.P$2 107.68,30.41 C11.+ 107.11,33.62 R31.2 | U$21.SOURCE 97.71,37.77 97.78,37.77 98.69,38.67 U$20.- 99.11,38.92 98.16,39.87 U$20.FB 98.16,41.14 | U$21.SOURCE 97.21,31.36 C13.- | R31.2 104.3,35.21 104.07,35.44 104.07,36.69 104.17,36.79 104.17,39.15 U$16.IN+ | R33.1 R31.2 | R38.1 87.05,36.16 U$19.IN- 88.64,39 89.42,39 90.3,39.87 D7.C v91.65,39.87 | v96.38,36.06 97.21,36.89 U$21.SOURCE
  Top 5.08: C13.- C11.+
  Bottom 0.305: v91.65,39.87 92.57,39.87 v96.38,36.06
N$52
  Top 0.305: R38.2 88.95,36.16 U$19.V+ 89.44,36.91 R37.1
N$53  (via drill 0.35)
  Top 0.305: U$19.V- 87.7,40.1 87.7,40.43 87.15,40.98 C14.1 88,41.99 v88,42.41 | v94.35,34.03 94.35,34.45 R40.2
  Bottom 0.305: v88,42.41 94.35,36.06 v94.35,34.03
N$54
  Top 0.305: R39.2 R40.1 95.38,36.91 96.63,38.17 96.7,38.17 U$20.+
N$55  (via drill 0.35)
  Top 0.305: R41.P$1 v94.35,25.9 | v98.16,36.06 U$21.DRAIN
  Bottom 0.305: v94.35,25.9 94.35,32.25 v98.16,36.06
N$56
  Top 0.305: R42.1 93.53,39.02 D7.A
N$57  (via drill 0.35)
  Top 0.152: v7.3,29.33 7.99,30.01 U$35.3
  Top 0.254: U$35.8 v7.99,44.95
  Bottom 0.152: v7.99,44.95 U$40.P$1 7.72,40.94 7.62,40.94 7.48,40.81 7.48,29.51 v7.3,29.33
N$58
  Top 0.305: U$22.OUT 71.17,41.04 C16.2 77.42,41.14 R48.2 78.55,40.72 79.8,41.98 80.95,41.98 82.08,40.85 82.08,37.95 81.9,37.77 81.83,37.77 U$24.GATE
N$59  (via drill 0.35)
  Top 0.305: R41.P$2 89.9,30.41 C13.+ 89.33,34 R37.2 | U$23.FB 80.38,39.62 U$23.- 80.82,38.17 80.75,38.17 79.85,37.26 U$24.SOURCE | U$24.SOURCE 79.05,36.88 C15.- | R37.2 R39.1 | U$19.IN+ 86.29,39.05 86.29,35.44 86.52,35.21 R37.2 | R44.1 69.27,36.16 U$22.IN- 70.86,39 71.64,39 72.52,39.87 D8.C v73.87,39.87 | v78.35,35.94 79.43,37.02 U$24.SOURCE
  Top 5.08: C15.- C13.+
  Bottom 0.305: v73.87,39.87 77.81,35.94 v78.35,35.94
N$60
  Top 0.305: R44.2 71.07,37.3 U$22.V+ 71.78,36.79 R43.1
N$61  (via drill 0.35)
  Top 0.305: U$22.V- 70.22,40.29 C16.1 70.22,41.99 v70.22,42.41 | v76.19,34.03 77.2,35.05 R46.2
  Bottom 0.305: v70.22,42.41 70.22,41.65 76.19,35.68 v76.19,34.03
N$62
  Top 0.305: R45.2 R46.1 77.2,37.03 78.34,38.17 78.92,38.17 U$23.+
N$63  (via drill 0.35)
  Top 0.305: U$24.DRAIN v80.38,36.06 | v76.57,25.9 R47.P$1
  Bottom 0.305: v80.38,36.06 76.57,32.25 v76.57,25.9
N$64
  Top 0.305: R48.1 75.75,39.02 D8.A
N$65
  Bottom 0.152: U$42.P$3 28.05,37.69 R65.1
N$66
  Top 0.305: U$25.OUT 53.39,41.04 C18.2 59.13,41.14 R54.2 60.77,40.72 62.02,41.98 63.17,41.98 64.3,40.85 64.3,37.95 64.12,37.77 64.05,37.77 U$27.GATE
N$67  (via drill 0.35)
  Top 0.305: R47.P$2 72.12,30.41 C15.+ 73.39,32.83 R43.2 | U$27.SOURCE 62.15,37.77 62.22,37.77 63.13,38.67 U$26.- 62.6,39.62 U$26.FB | U$27.SOURCE 61.65,31.36 C17.- | R43.2 R45.1 | U$22.IN+ 68.51,39.05 68.51,35.44 68.86,35.09 R43.2 | R50.1 51.49,36.16 U$25.IN- 51.49,37.65 52.44,38.6 54.1,38.6 D9.C v56.09,39.87 | U$27.SOURCE 61.65,36.64 v61.07,36.06
  Top 5.08: C17.- C15.+
  Bottom 0.305: v61.07,36.06 59.9,36.06 v56.09,39.87
N$68
  Top 0.305: R50.2 53.39,36.16 U$25.V+ 55.21,37.4 R49.1
N$69  (via drill 0.35)
  Top 0.305: U$25.V- 52.44,40.29 C18.1 52.44,41.99 v52.44,42.41 | v58.79,34.79 58.79,34.96 R52.2
  Bottom 0.305: v52.44,42.41 58.79,36.06 v58.79,34.79
N$70
  Top 0.305: R51.2 R52.1 60.32,37.42 61.07,38.17 61.14,38.17 U$26.+
N$71  (via drill 0.35)
  Top 0.305: U$27.DRAIN v62.6,36.06 | v58.79,25.9 R53.P$1
  Bottom 0.305: v62.6,36.06 58.79,32.25 v58.79,25.9
N$72
  Top 0.305: D9.A 57.97,39.02 R54.1
N$73  (via drill 0.35)
  Top 0.254: U$35.7 9.49,42.84 v10.53,41.8 | v10.53,39.87 v18.15,39.87 24.2,39.87 26.55,42.22 26.55,42.61 U$36.7 | v19.03,41.8 18.38,42.46 U$37.7
  Top 0.305: v6.72,39.87 v10.53,39.87
  Bottom 0.254: v10.53,41.8 v10.53,39.87 | v18.15,39.87 18.15,40.91 v19.03,41.8
  Bottom 0.305: R55.2 5.74,35.02 6.47,35.75 6.47,39.62 v6.72,39.87
N$74  (via drill 0.35)
  Top 0.254: U$36.6 28.77,44.87 v28.69,44.95 | U$37.6 19.88,44.87 v19.8,44.95 | v12.43,43.3 11.02,43.3 U$35.6
  Bottom 0.254: v19.8,44.95 18.76,45.99 18.15,45.99 | R56.2 v12.43,43.3 12.43,44.78 13.65,45.99 | 26.11,45.99 27.65,45.99 v28.69,44.95
  Bottom 0.305: 26.11,45.99 18.15,45.99 13.65,45.99
N$75  (via drill 0.35)
  Top 0.254: U$37.4 18.38,30.22 19.15,29.45 18.64,28.94 16.88,28.94
  Top 0.305: 9.49,30.98 9.49,30.75 11.3,28.94 16.88,28.94 17.37,28.94 | 9.49,30.98 U$35.4 | 18.88,29.71 19.15,29.45 v19.42,29.18 | v27.04,29.71 27.04,31.1 U$36.4 | R57.2 11.34,24.12 9.84,25.62 9.84,30.63 9.49,30.98
  Bottom 0.305: v19.42,29.18 22.8,29.18 22.94,29.03 26.35,29.03 v27.04,29.71
  other vias: 18.11,24.12
N$76  (via drill 0.35)
  Top 0.305: R58.2 10.15,22.47 6.49,26.13 U$35.2 7.18,32.03 7.18,32.46 7.36,32.64 11.61,32.64 13.07,31.18 13.07,30.21 13.25,30.03 14.5,30.03 14.68,30.21 14.68,30.64 U$37.2 16.07,32.03 16.07,33.22 17.14,34.28 21.2,34.28 v21.96,33.52 | U$36.2 24.27,32.68 v23.43,33.52
  Bottom 0.305: v23.43,33.52 v21.96,33.52
  other vias: 18.11,22.47
N$77  (via drill 0.35)
  Top 0.254: U$35.1 4.99,34.33 5.45,34.79 13.07,34.79 | 13.07,34.79 21.96,34.79 22.77,33.98 U$36.1 | U$37.1 13.88,33.98 13.07,34.79
  Top 0.305: R59.2 4.99,21.7 U$35.1
  other vias: 5.74,20.95
N$78  (via drill 0.35)
  Top 0.254: U$35.9 7.21,42.61 7.21,42.22 8.2,41.23 8.41,41.02 14.21,41.02 | 14.21,41.02 15.38,42.18 U$37.9 | 14.21,41.02 23.1,41.02 24.5,42.41 24.5,43.1 U$36.9
  Top 0.305: U$35.9 5.79,42.64 5.79,42.21 4.18,40.59 v4.18,23.36
  Bottom 0.305: R60.2 5.11,23.36 v4.18,23.36
N$79  (via drill 0.35)
  Top 0.254: v14.34,44.95 14.34,44.14 13.88,43.68 | U$37.10 11.22,45.99 10.53,45.99
  Top 0.305: U$36.10 20.11,45.99 10.53,45.99 6.72,45.99 4.99,44.26 U$35.10 | U$37.10 13.88,43.68 13.88,43.91
  Bottom 0.254: 14.95,42.26 14.95,44.34 v14.34,44.95
  Bottom 0.305: R61.2 16.37,30.87 16.1,31.15 16.1,40.7 14.95,41.85 14.95,42.26
N$81
  Bottom 0.203: 3.3V_BUCK.4 23.46,13.14 R67.2 24.96,13.11 R72.1
N$82
  Bottom 0.203: 3.3V_BUCK.8 15.84,8.19 C20.1
N$83
  Bottom 0.203: 3.3V_BUCK.6 20.18,6.89 R70.2
N$84  (via drill 0.35)
  Top 0.254: v19.93,19.55 19.93,15.91 C22.1
  Bottom 0.203: C22.1 20.31,13.26 3.3V_BUCK.3
  Bottom 0.254: C24.1 v19.93,19.55
  other vias: 20.31,15.53
N$85
  Bottom 0.203: R71.2 C22.2
SW
  pour Bottom: 18.15,14.47 18.15,12.57 16.75,12.57 16.75,9.52 16.88,9.39 9.26,9.39 9.26,19.55 15.35,19.55 15.35,14.47
VCC  (via drill 0.35)
  Top 0.305: R53.P$2 54.34,30.41 C17.+ 53.77,34.26 R49.2 | R49.2 R51.1 | U$25.IN+ 51.49,38.68 50.73,37.93 50.73,35.44 50.91,35.26 53.96,35.26 54.43,35.72 R49.2 | v19.29,4.57 16.62,4.57 14.34,6.85 14.34,15.49 v17,18.16 17,18.83 21.16,22.98 26.78,22.98 | v40.21,22.98 26.78,22.98 | v28.05,24.25 26.78,22.98
  Top 5.08: C17.+ 49.64,30.98 | 49.64,30.98 44.49,30.98 CHARGE.1 MTR.1 43.13,37.5 49.64,30.98
  Bottom 0.305: R68.2 v17,18.16 | v19.29,4.57 19.29,3.34 C23.1 | R66.1 v28.05,24.25
  pour Bottom: 18.66,1.77 18.66,9.27 19.42,9.27 19.42,5.58 20.69,4.31 28.31,4.31 28.31,1.77
  pour Top: 47.36,44.95 47.36,22.09 39.74,22.09 39.74,44.95

### Text on the board
tNames: PURDUE ROBOMASTER SUPER-CAPACITOR BOARD | BEN MIRVISH / CHENGMING ZHANG